# Altium schematic sheet PP7_USB.SchDoc
size 199 x 119 mm
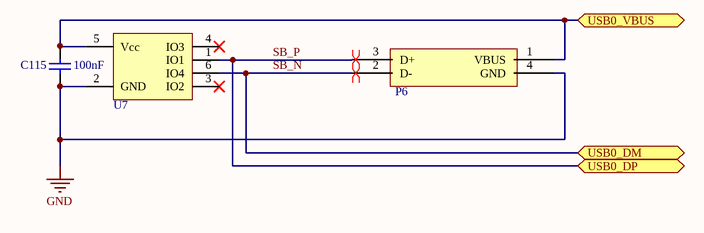
[diagram p0: PP7_USB.SchDoc]

## Parts
C115  value 100nF  [CAPC1608X08]  (hidden comment: Cap 100nF)
P6  1734346-1  [CONN4-292304]  (value not drawn)
U7  TPD4E1U06DBVR  [DBV6-M]  (value not drawn)

## Ports
USB0_DM, USB0_DP, USB0_VBUS

## Nets
GND: C115.2 P6.4(GND) U7.2(GND)
SB_N: P6.2(D-) U7.6(IO4) ; port USB0_DM
SB_P: P6.3(D+) U7.1(IO1) ; port USB0_DP
USB0_VBUS: C115.1 P6.1(VBUS) U7.5(Vcc) ; port USB0_VBUS

Not connected (* = marked no-connect by the designer): U7 3(IO2)* 4(IO3)*

## Layout directives
differential pair; net class SBS: SB_N, SB_P

## Library data of the parts
C115 = Cap Semi: Capacitor; Fabricant: KEMET; Fournisseur: Farnell; RefFabricant: C0603T104K5RALTU; RefFournisseur: 2522432; Case: 0603 [1608 Metric]
P6 = 67068-8010: Connecteur USB-Type-B; Fabricant: TE CONNECTIVITY; RefFournisseur: 1321918; Fournisseur: Farnell; RefFabricant: 1734346-1; DataSheet: http://www.farnell.com/datasheets/2365064.pdf
U7 = TPD4E1U06DBVR: Protection_ESD; RefFournisseur: 2496529; Fournisseur: Farnell; Fabricant: TEXAS INSTRUMENTS; DataSheet: http://www.ti.com/lit/ds/symlink/tpd4e1u06.pdf; RefFabricant: TPD4E1U06DBVR